# Altium schematic sheet SN74CBTLV3257DBQR.SchDoc: Multiplexer/Demultiplexer
size A4; MaxSupply: 3V6; MinSupply: 2V3; Class: Logic; Subclass: Switch
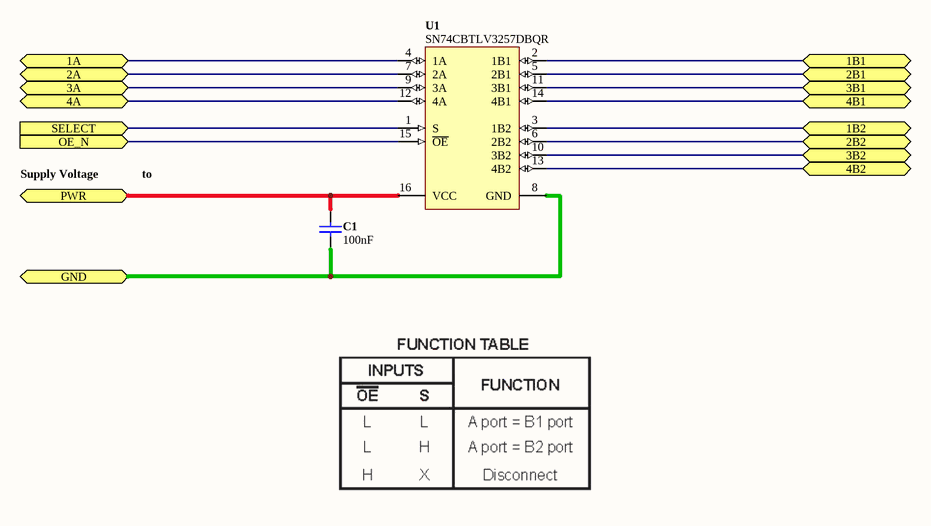
[diagram p0: SN74CBTLV3257DBQR.SchDoc]

## Parts
C1  value 100nF  [CAPC0402(1005)60_N]  (hidden comment: CAP 100nF 6.3V 0402(1005))
U1  SN74CBTLV3257DBQR  [SSOP-16_N]

## Ports
1A (bidir), 1B1 (bidir), 1B2 (bidir), 2A (bidir), 2B1 (bidir), 2B2 (bidir), 3A (bidir), 3B1 (bidir), 3B2 (bidir), 4A (bidir), 4B1 (bidir), 4B2 (bidir), GND, OE_N (in), PWR, SELECT (in)

## Nets
1A: U1.4(1A) ; port 1A
1B1: U1.2(1B1) ; port 1B1
1B2: U1.3(1B2) ; port 1B2
2A: U1.7(2A) ; port 2A
2B1: U1.5(2B1) ; port 2B1
2B2: U1.6(2B2) ; port 2B2
3A: U1.9(3A) ; port 3A
3B1: U1.11(3B1) ; port 3B1
3B2: U1.10(3B2) ; port 3B2
4A: U1.12(4A) ; port 4A
4B1: U1.14(4B1) ; port 4B1
4B2: U1.13(4B2) ; port 4B2
GND: C1.1 U1.8(GND) ; port GND
OE_N: U1.15(~{OE}) ; port OE_N
PWR: C1.2 U1.16(VCC) ; port PWR
SELECT: U1.1(S) ; port SELECT

## Notes on the sheet
- Supply Voltage
- to
- Sheet Title
- Project Title
- Size:
- Date:
- A4
- Item:
- Time:
- Revision:
- Sheet
- of
- File:

## Library data of the parts
C1 = CMP-1034-02062-1: CAP 100nF 6.3V ±20% 0402 (1005 Metric) Thickness 0.6mm SMD; Case-EIA: 0402; Case-Metric: 1005; Technology: SMT; Max Thickness: 0.6 mm; Rated Voltage: 6.3 V; Tolerance: ±20%
U1 = CMP-5097-00006-1: IC QUAD 1:2 FET MUX/DEMUX 16SSOP; Channel: 4; Class: Logic; Sub-class: Switch; Suplply Voltage: 2.3V to 3.6V; Datasheet: http://www.ti.com/lit/ds/symlink/sn74cbtlv3257.pdf; Package Type: SSOP